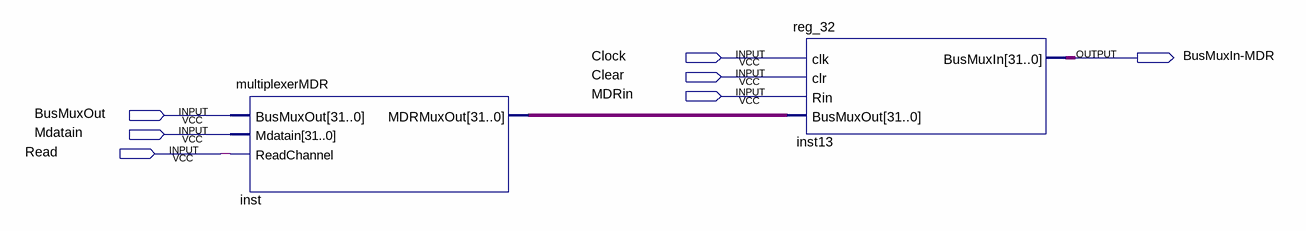
[diagram p0: schematic sheet]
// Quartus schematic MDR.bdf as structural Verilog: 2 symbols, 7 pins
module MDR (
  input  Clock,
  input  Clear,
  input  MDRin,
  input  BusMuxOut,
  input  Mdatain,
  input  Read,
  output \BusMuxIn-MDR 
);

  wire [31:0] inst13_busmuxin, inst_mdrmuxout;

  multiplexerMDR inst (
    .BusMuxOut({32{BusMuxOut}}), .Mdatain({32{Mdatain}}), .ReadChannel(Read), .MDRMuxOut(inst_mdrmuxout));
  reg_32 inst13 (.clk(Clock), .clr(Clear), .Rin(MDRin), .BusMuxOut(inst_mdrmuxout), .BusMuxIn(inst13_busmuxin));
endmodule
